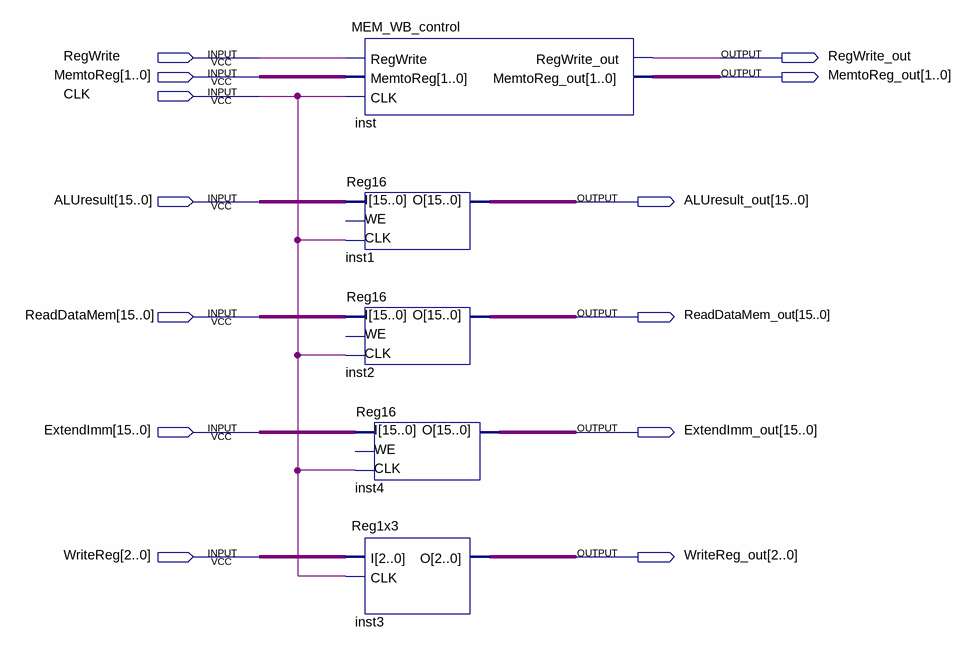
[diagram p0: schematic sheet]
// Quartus schematic MEM_WB.bdf as structural Verilog: 5 symbols, 13 pins
module MEM_WB (
  input  RegWrite,
  input  [1:0] MemtoReg,
  input  CLK,
  input  [15:0] ALUresult,
  input  [15:0] ReadDataMem,
  input  [15:0] ExtendImm,
  input  [2:0] WriteReg,
  output RegWrite_out,
  output [1:0] MemtoReg_out,
  output [15:0] ALUresult_out,
  output [15:0] ReadDataMem_out,
  output [15:0] ExtendImm_out,
  output [2:0] WriteReg_out
);

  MEM_WB_control inst (
    .RegWrite(RegWrite), .MemtoReg(MemtoReg), .CLK(CLK), .RegWrite_out(RegWrite_out),
    .MemtoReg_out(MemtoReg_out));
  Reg16 inst1 (.CLK(CLK), .I(ALUresult), .O(ALUresult_out));  // open: WE
  Reg16 inst2 (.CLK(CLK), .I(ReadDataMem), .O(ReadDataMem_out));  // open: WE
  Reg16 inst4 (.CLK(CLK), .I(ExtendImm), .O(ExtendImm_out));  // open: WE
  Reg1x3 inst3 (.I(WriteReg), .CLK(CLK), .O(WriteReg_out));
endmodule
